# Altium project RfRouterBoard.PrjPcb
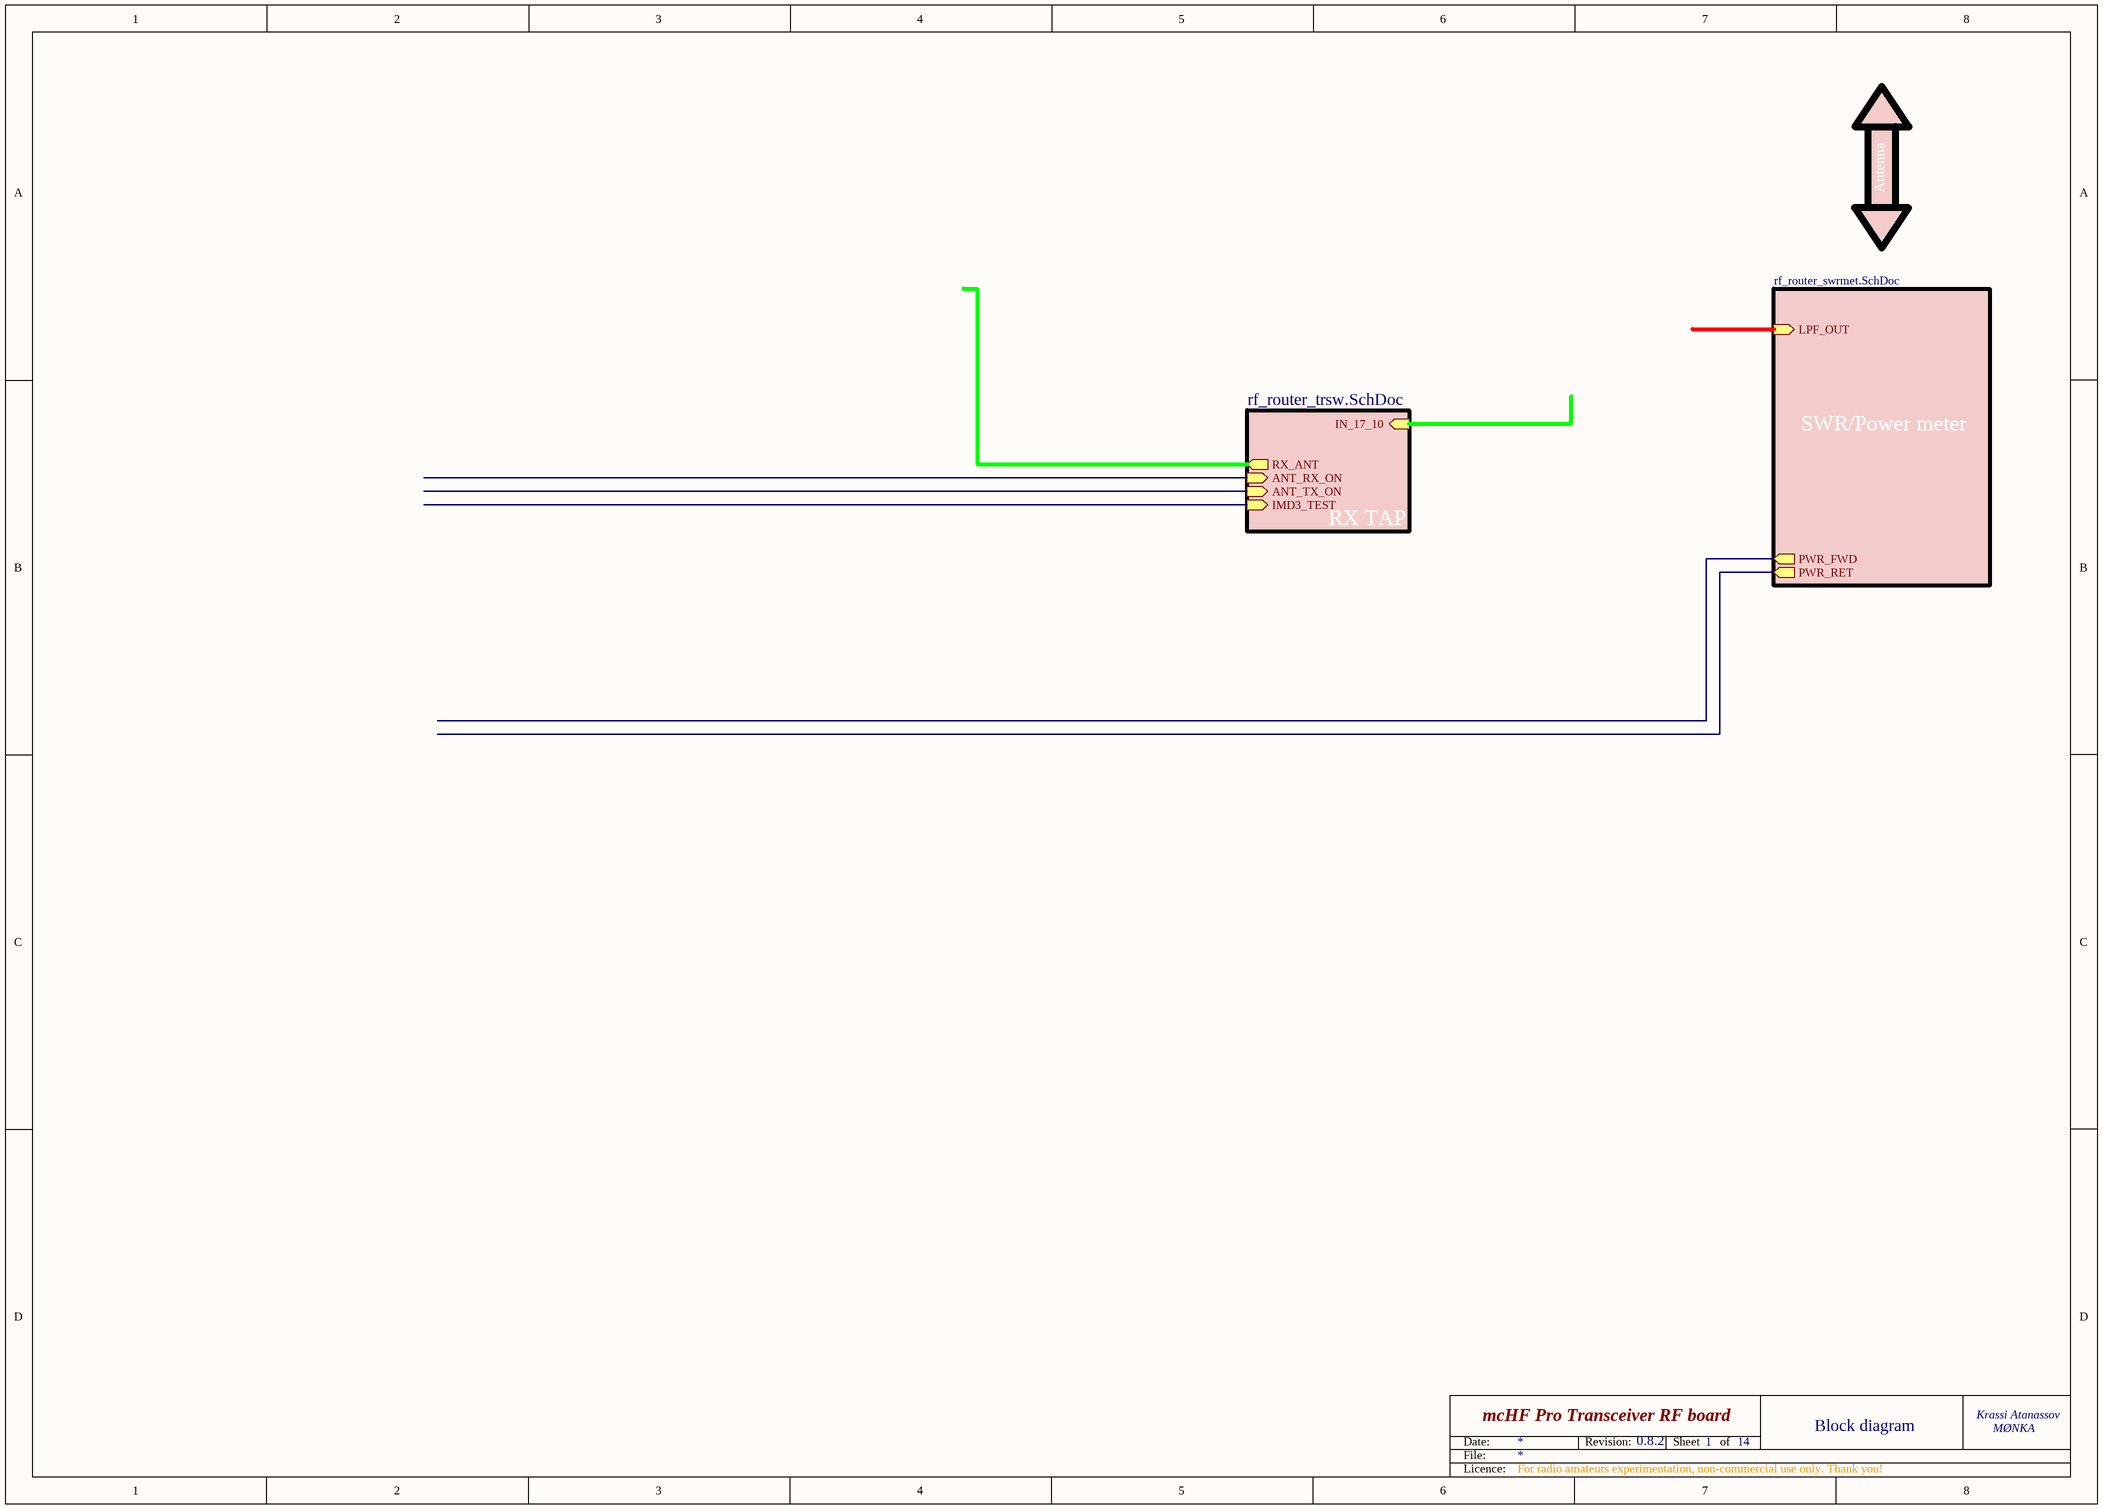
[diagram p0: rf_router_main.SchDoc]
3 sheets, 41 parts. Net scope: hierarchical (ports join the sheet entries above them; power ports are global).
Sheets:
  rf_router_main.SchDoc
    RX TAP = rf_router_trsw.SchDoc
    SWR/Power meter = rf_router_swrmet.SchDoc

## Sheet rf_router_main.SchDoc: mcHF Pro Transceiver RF board
size A3; Author: Krassi Atanassov; CompanyName: MØNKA; Engineer: For radio amateurs experimentation, non-commercial use only. Thank you!; Revision: 0.8.2; SheetTotal: 14

### Sub-sheets
RX TAP = rf_router_trsw.SchDoc: RX_ANT (out), ANT_RX_ON (in), ANT_TX_ON (in), IN_17_10 (in), IMD3_TEST (in)
SWR/Power meter = rf_router_swrmet.SchDoc: LPF_OUT (in), PWR_FWD (out), PWR_RET (out)

### Notes on the sheet
- Antenna
- 1
- Block diagram
- Date:
- File:
- Revision:
- Sheet
- of
- Licence:

## Sheet rf_router_trsw.SchDoc: mcHF Pro Transceiver RF board
size A3; Author: Krassi Atanassov; CompanyName: MØNKA; Engineer: For radio amateurs experimentation, non-commercial use only. Thank you!; Revision: 0.8.2; SheetTotal: 14
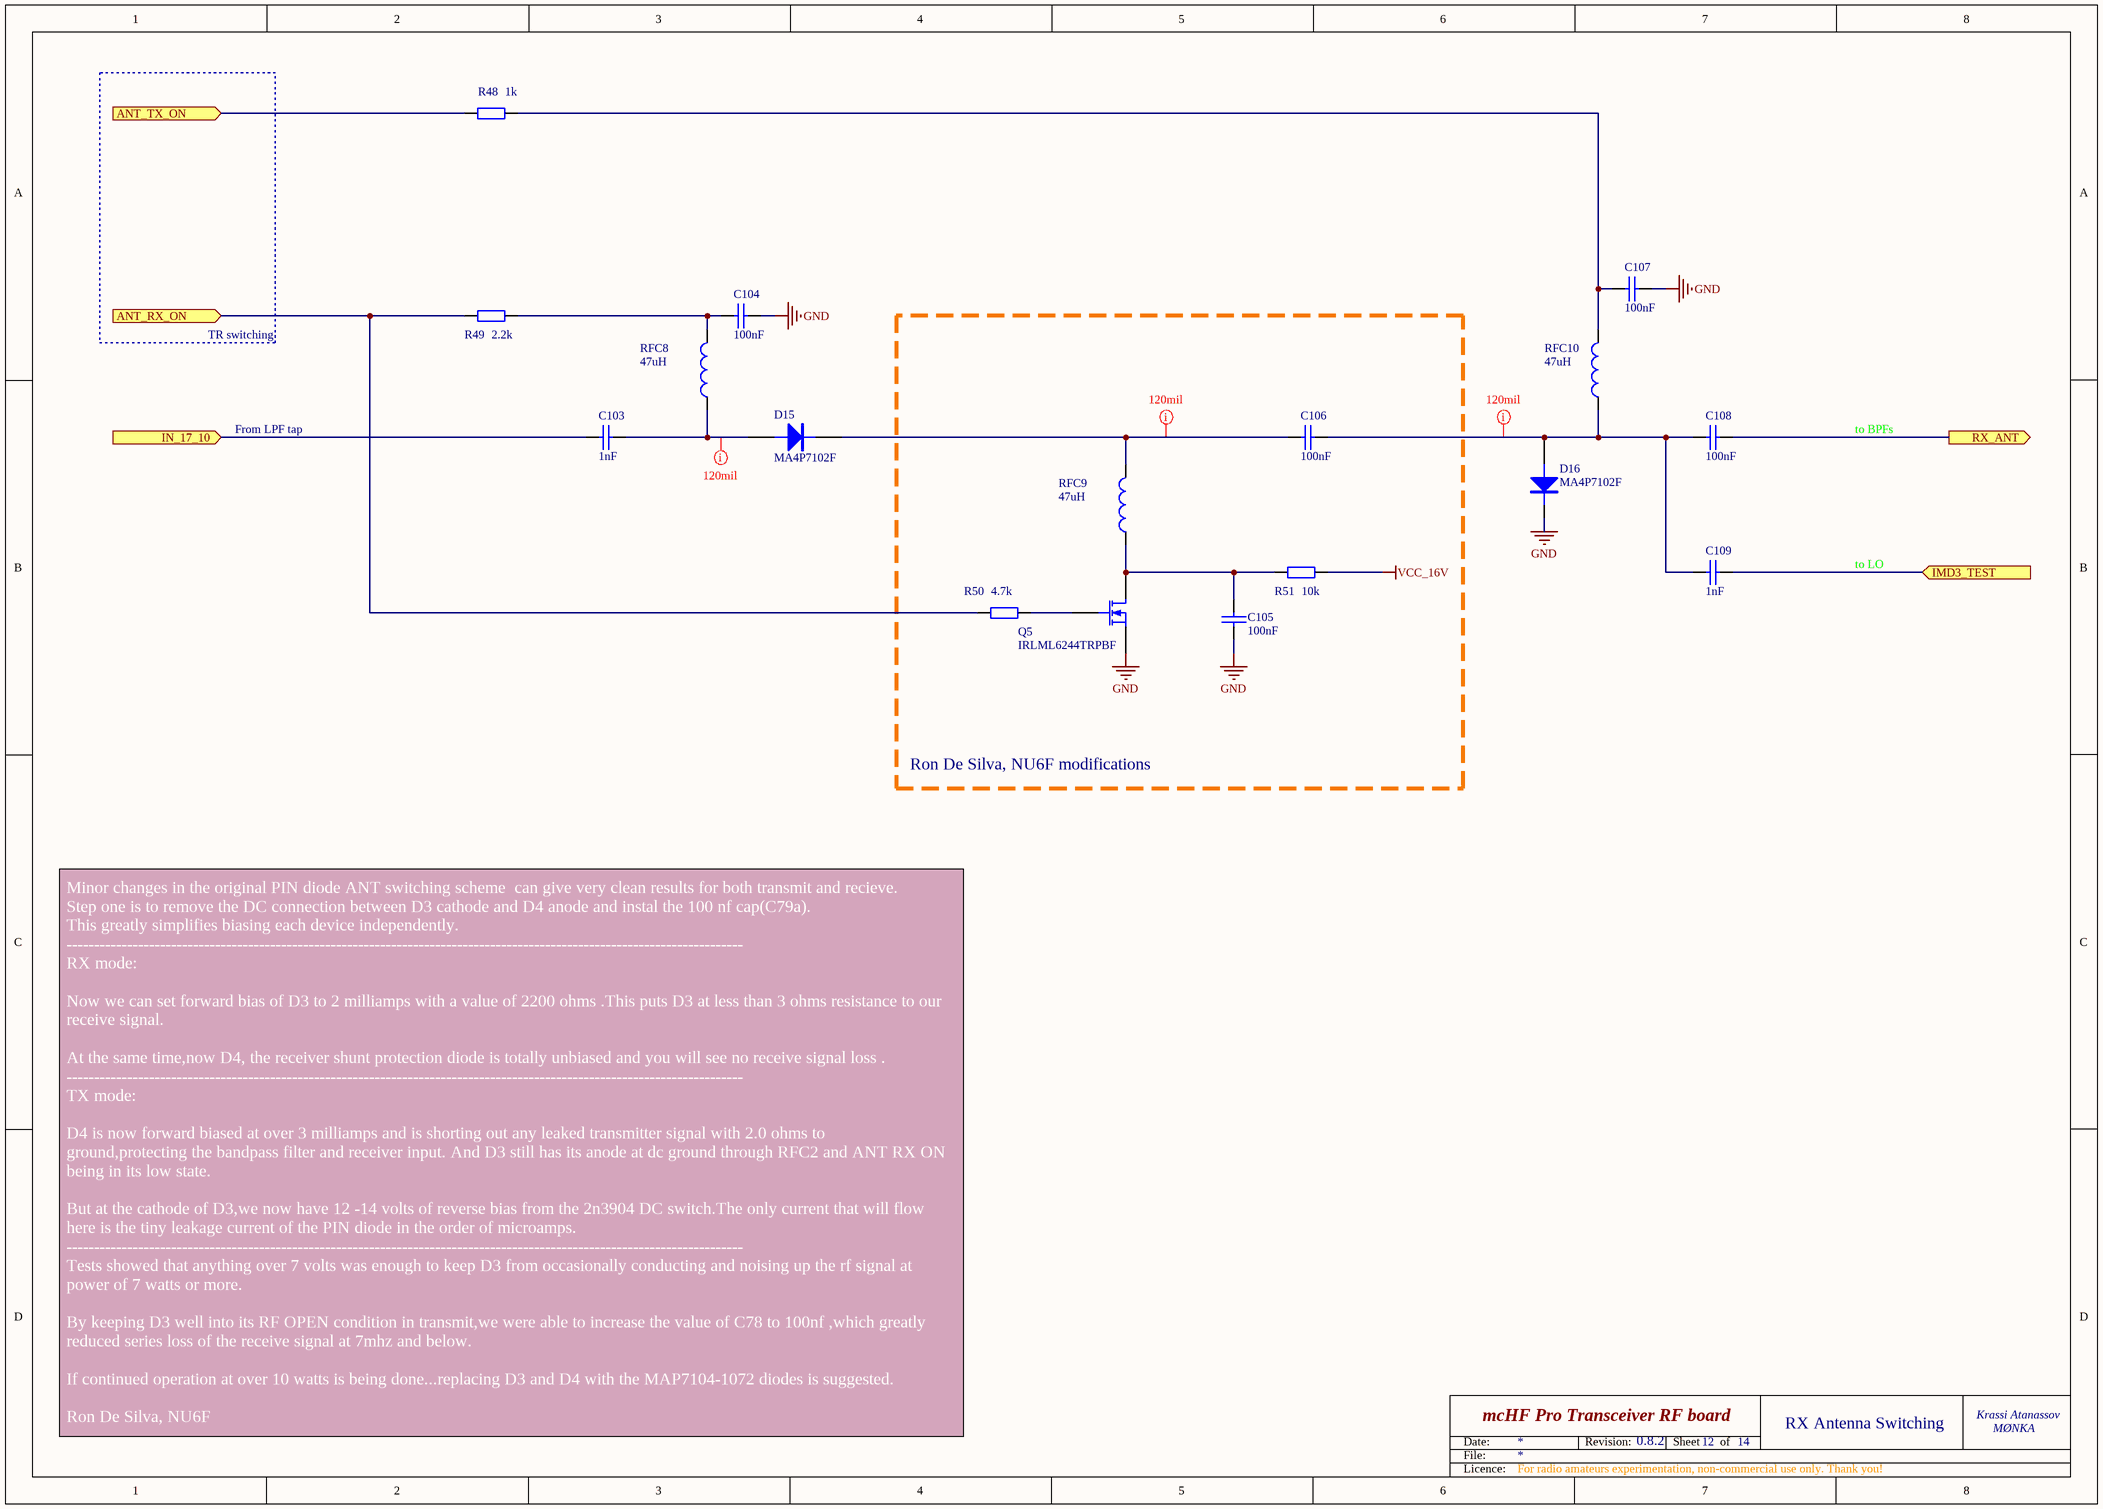
[diagram p1: rf_router_trsw.SchDoc]

### Parts
C103  1nF  [0805]
C104  100nF  [0805]
C105  100nF  [0805]
C106  100nF  [0805]
C107  100nF  [0805]
C108  100nF  [0805]
C109  1nF  [0805]
D15  MA4P7102F  [1072T]
D16  MA4P7102F  [1072T]
Q5  IRLML6244TRPBF  [SOT-23-Pro]
R48  1k  [0805]
R49  2.2k  [0805]
R50  4.7k  [0805]
R51  10k  [0805]
RFC8  47uH  [0805]
RFC9  47uH  [0805]
RFC10  47uH  [0805]

### Blocks framed on the sheet
Ron De Silva, NU6F modifications: C105 C106 Q5 R50 R51 RFC9

### Ports
ANT_RX_ON (in), ANT_TX_ON (in), IMD3_TEST (in), IN_17_10 (in), RX_ANT (out)

### Nets
GND: C104.1 C105.2 C107.1 D16.1(K) Q5.2(S)
VCC_16V: R51.2
NetC103_1: C103.1 D15.2(A) RFC8.1
NetC103_2: C103.2 ; port IN_17_10
NetC104_2: C104.2 R49.2 RFC8.2
NetC105_1: C105.1 Q5.3(D) R51.1 RFC9.1
NetC106_1: C106.1 C108.2 C109.2 D16.2(A) RFC10.1
NetC106_2: C106.2 D15.1(K) RFC9.2
NetC107_2: C107.2 R48.1 RFC10.2
NetC108_1: C108.1 ; port RX_ANT
NetC109_1: C109.1 ; port IMD3_TEST
NetQ5_1: Q5.1(G) R50.2
NetR48_2: R48.2 ; port ANT_TX_ON
NetR49_1: R49.1 R50.1 ; port ANT_RX_ON

### Layout directives
rule Width Constraint [Pref Width = 120mil    Min Width = 120mil    Max Width = 120mil]: NetC103_1, NetC106_1, NetC106_2

### Notes on the sheet
- TR switching
- From LPF tap
- to BPFs
- to LO
- Minor changes in the original PIN diode ANT switching scheme  can give very clean results for both transmit and recieve.
  Step one is to remove the DC connection between D3 cathode and D4 anode and instal the 100 nf cap(C79a).
  This greatly simplifies biasing each device independently.
  ---------------------------------------------------------------------------------------------------------------------------
  RX mode:
  Now we can set forward bias of D3 to 2 milliamps with a value of 2200 ohms .This puts D3 at less than 3 ohms resistance to our receive signal.
  At the same time,now D4, the receiver shunt protection diode is totally unbiased and you will see no receive signal loss .
  ---------------------------------------------------------------------------------------------------------------------------
  TX mode:
  D4 is now forward biased at over 3 milliamps and is shorting out any leaked transmitter signal with 2.0 ohms to
  ground,protecting the bandpass filter and receiver input. And D3 still has its anode at dc ground through RFC2 and ANT RX ON being in its low state.
  But at the cathode of D3,we now have 12 -14 volts of reverse bias from the 2n3904 DC switch.The only current that will flow here is the tiny leakage current of the PIN diode in the order of microamps.
  ---------------------------------------------------------------------------------------------------------------------------
  Tests showed that anything over 7 volts was enough to keep D3 from occasionally conducting and noising up the rf signal at power of 7 watts or more.
  By keeping D3 well into its RF OPEN condition in transmit,we were able to increase the value of C78 to 100nf ,which greatly reduced series loss of the receive signal at 7mhz and below.
  If continued operation at over 10 watts is being done...replacing D3 and D4 with the MAP7104-1072 diodes is suggested.
  Ron De Silva, NU6F
- 12
- RX Antenna Switching
- Date:
- File:
- Revision:
- Sheet
- of
- Licence:

### Library data of the parts
C103 C108 C109 = CAP: Capacitor; Voltage: 100V
  C103: Price: 0.083
C104-C107 = CAP: Capacitor; Voltage: 100V; QT Order: QCC-00154; Price: 0.068
D15 D16 = MA4P7102F: MELF & HIPAX PIN Diod; Order: DK 1465-1236-1-ND; Price: 2.20
Q5 = MOSFET-N: N-Channel MOSFET; QT Order: QCT-00022; QT Price: 0.28; Price: 0.231
R48 = RES: Resistor; QT Order: QCR-00309; Price: 0.007
R49-R51 = RES: Resistor; QT Order: QCR-00339; Price: 0.012
RFC8-RFC10 = TDK-NLV25T: INDUCTOR, SIGNAL LINE, 47UH, 1005; Price: 0.166

## Sheet rf_router_swrmet.SchDoc: mcHF Pro Transceiver RF board
size A3; Author: Krassi Atanassov; CompanyName: MØNKA; Engineer: For radio amateurs experimentation, non-commercial use only. Thank you!; Revision: 0.8.2; SheetTotal: 14
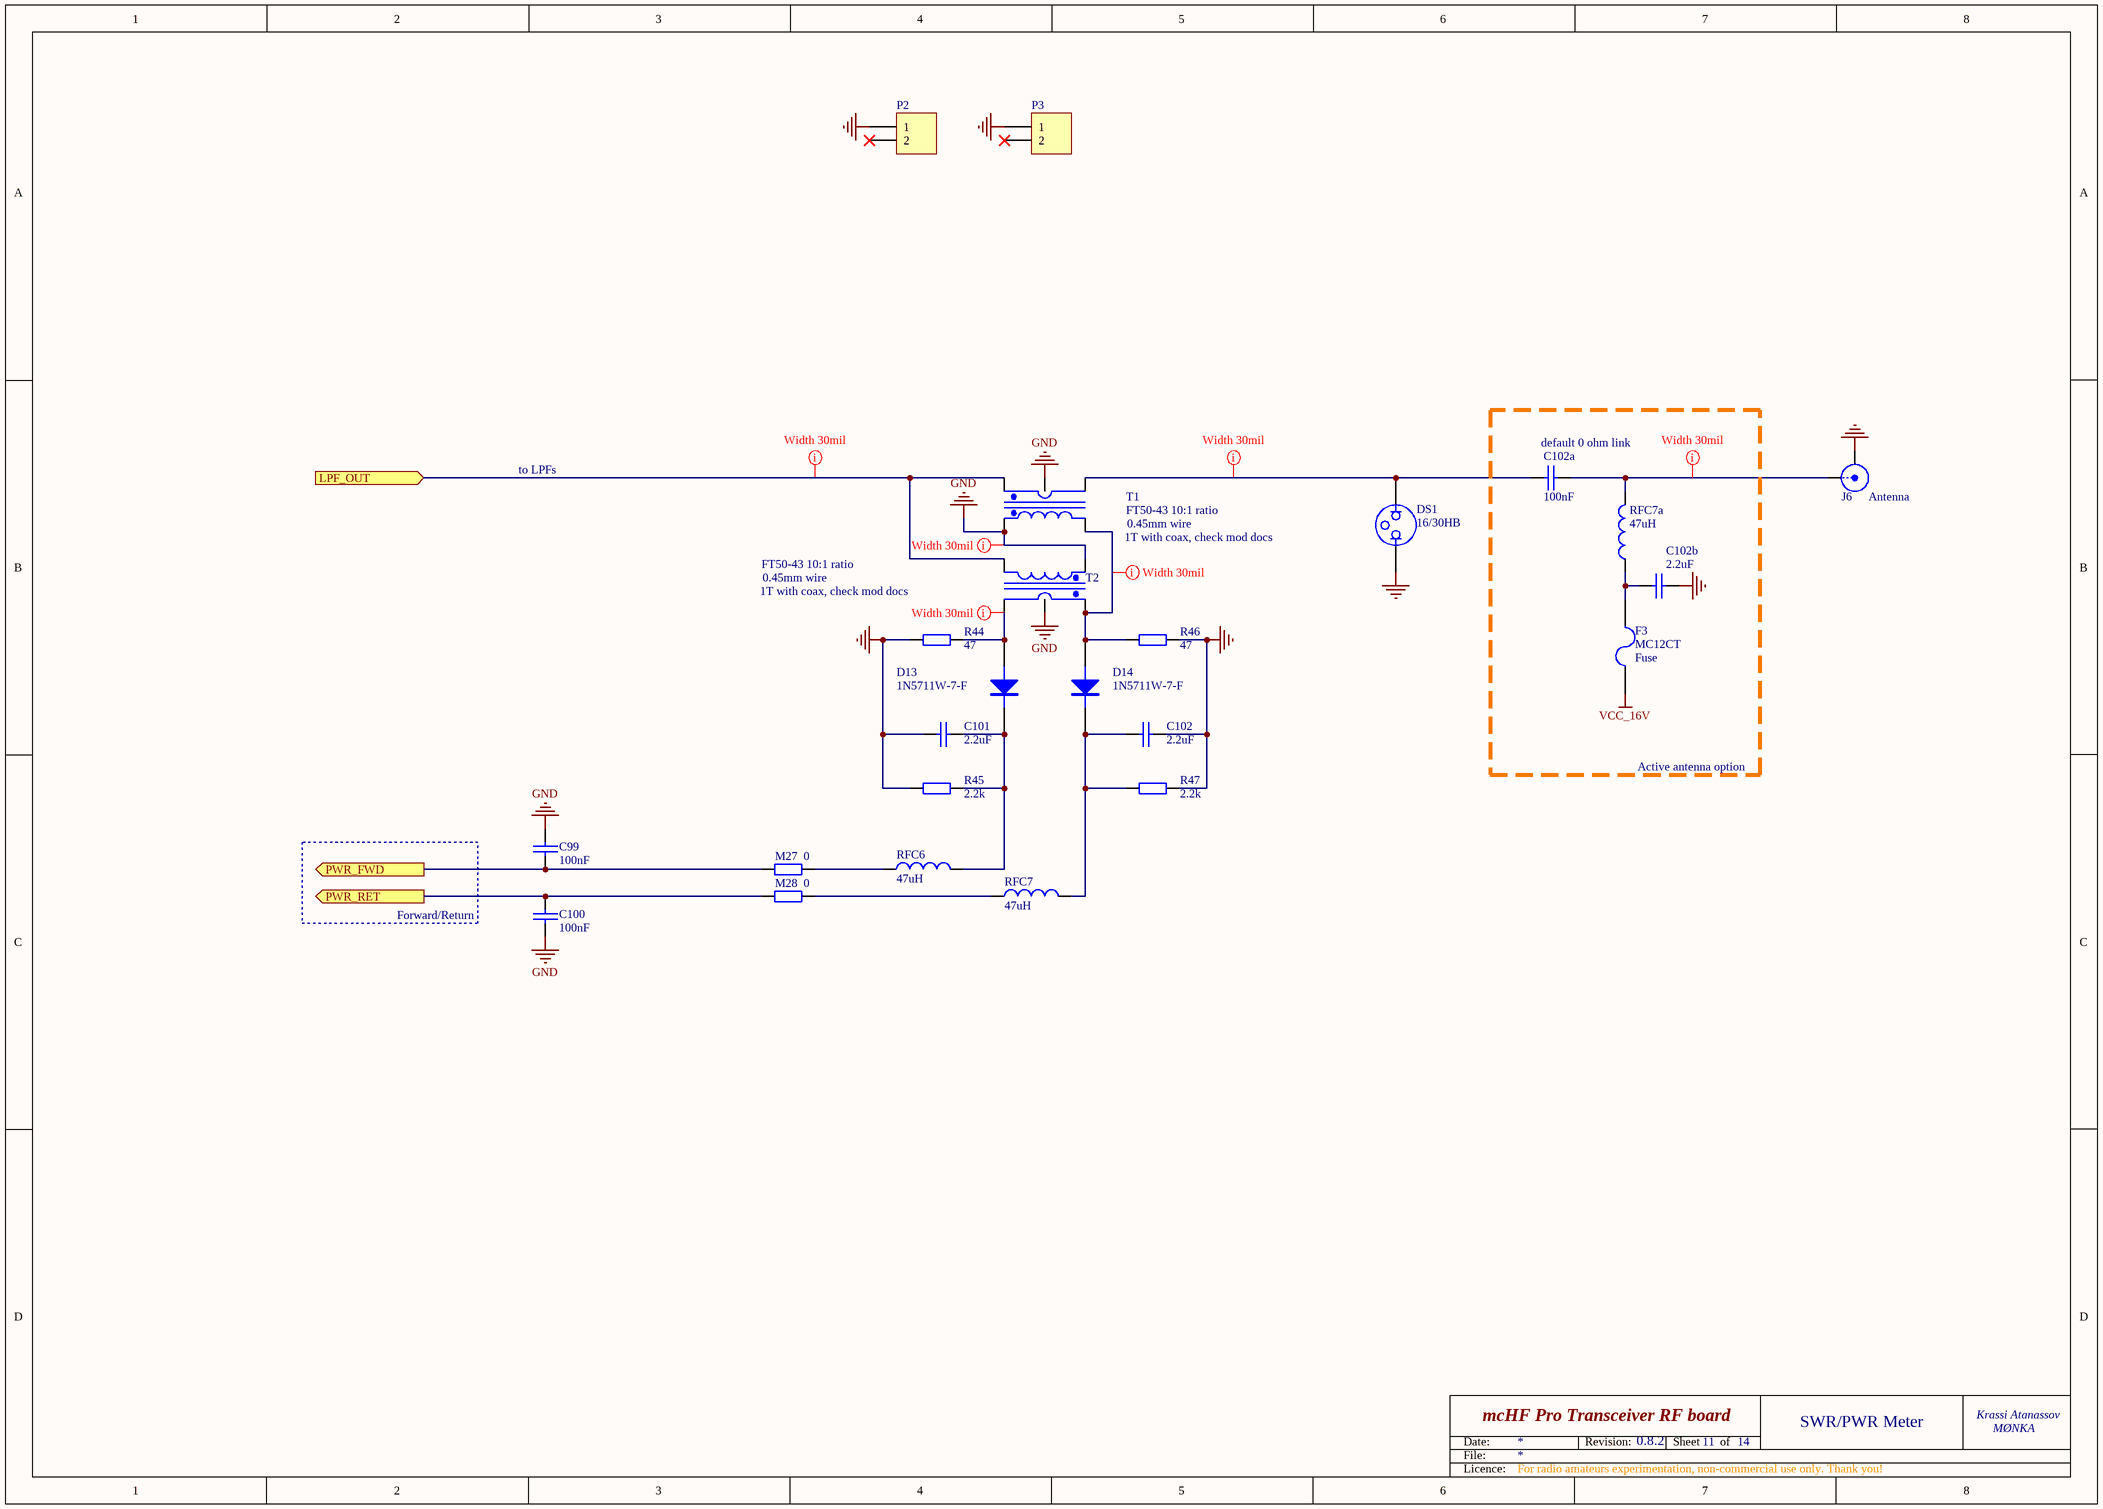
[diagram p2: rf_router_swrmet.SchDoc]

### Parts
C99  100nF  [0805]
C100  100nF  [0805]
C101  2.2uF  [0805]
C102  2.2uF  [0805]
C102a  100nF  [0805]  (no BOM)
C102b  2.2uF  [0805]  (no BOM)
D13  1N5711W-7-F  [SOD87]
D14  1N5711W-7-F  [SOD87]
DS1  16/30HB  [NEON]
F3  MC12CT  [1206]  (no BOM)
J6  Antenna  [BNC_RA CON]
M27  0  [0805]
M28  0  [0805]
P2  Header 2  [SIP2]  (value not drawn)
P3  Header 2  [SIP2]  (value not drawn)
R44  47  [0805]
R45  2.2k  [0805]
R46  47  [0805]
R47  2.2k  [0805]
RFC6  47uH  [0805]
RFC7  47uH  [0805]
RFC7a  47uH  [0805]  (no BOM)
T1  FT50-43 10:1 ratio  [SWR_TR _new]
T2  FT50-43 10:1 ratio  [SWR_TR _new]

### Ports
LPF_OUT (in), PWR_FWD (out), PWR_RET (out)

### Nets
GND: C99.1 C100.2 C101.1 C102.2 C102b.2 DS1.1 J6.2(Y) P2.1 P3.1 R44.1 R45.1 R46.2 R47.2 T1.1(Pri+) T1.5(Shield) T2.1(Pri+) T2.5(Shield)
VCC_16V: F3.2
NetC99_2: C99.2 M27.2 ; port PWR_FWD
NetC100_1: C100.1 M28.2 ; port PWR_RET
NetC101_2: C101.2 D13.2(K) R45.2 RFC6.2
NetC102_1: C102.1 D14.2(K) R47.1 RFC7.2
NetC102a_1: C102a.1 J6.1(X) RFC7a.2
NetC102a_2: C102a.2 DS1.2 T1.4(Sec-)
NetC102b_1: C102b.1 F3.1 RFC7a.1
NetD13_1: D13.1(A) R44.2 T2.4(Sec-)
NetD14_1: D14.1(A) R46.1 T1.2(Pri-) T2.3(Sec+)
NetM27_1: M27.1 RFC6.1
NetM28_1: M28.1 RFC7.1
NetT1_3: T1.3(Sec+) T2.2(Pri-) ; port LPF_OUT

Not connected (* = marked no-connect by the designer): P2 2*; P3 2*

### Layout directives
rule Width Constraint [Pref Width = 30mil    Min Width = 30mil    Max Width = 30mil]: GND, NetC102a_1, NetC102a_2, NetD13_1, NetD14_1, NetT1_3

### Notes on the sheet
- (near C102a) default 0 ohm link
- to LPFs
- 0.45mm wire
- 1T with coax, check mod docs
- (near R44) 1T with coax, check mod docs
- Active antenna option
- Forward/Return
- 11
- SWR/PWR Meter
- Date:
- File:
- Revision:
- Sheet
- of
- Licence:

### Library data of the parts
C99 C100 = CAP: Capacitor; QT Order: QCC-00154; Price: 0.068
C101 C102 C102b = CAP: Capacitor; QT Order: QCC-00103; Price: 0.115
C102a = CAP: as C104 on sheet rf_router_trsw; Price: 0.068
D13 D14 = PMEG6010CEH: RF DIODE SCHOTTKY 70V, SOD-123F; Order: DK 1N5711W-FDITR-ND; QT Order: QCD-00034; Price: 0.085
DS1 = 16/30HB: NEON LAMP, WIRE ENDED, T2; Notes: post assembly; Price: 0.243
F3 = Fuse: QT Order: QCI-00216; Price: 0.134; Function: Fuse
J6 = BNC: RF COAXIAL, BNC, JACK; Notes: post assembly; Price: 0.69
M27 M28 = RES: Resistor; QT Order: QCR-00268; Price: 0.009
P2 P3 = Header 2: Header, 2-Pin
R44 R46 = RES: Resistor; QT Order: QCR-00293; Price: 0.052
R45 R47 = RES: Resistor; QT Order: QCR-00333; Price: 0.046
RFC6 RFC7 RFC7a = TDK-NLV25T: INDUCTOR, SIGNAL LINE, 47UH, 1005; Price: 0.166
T1 T2 = SWR_TR: SWR Bridge transformer; Notes: post assembly; Price: 0.795

## Nets that join several sheets
GND: rf_router_trsw (5 pins), rf_router_swrmet (17 pins)
VCC_16V: rf_router_trsw (R51.2), rf_router_swrmet (F3.2)